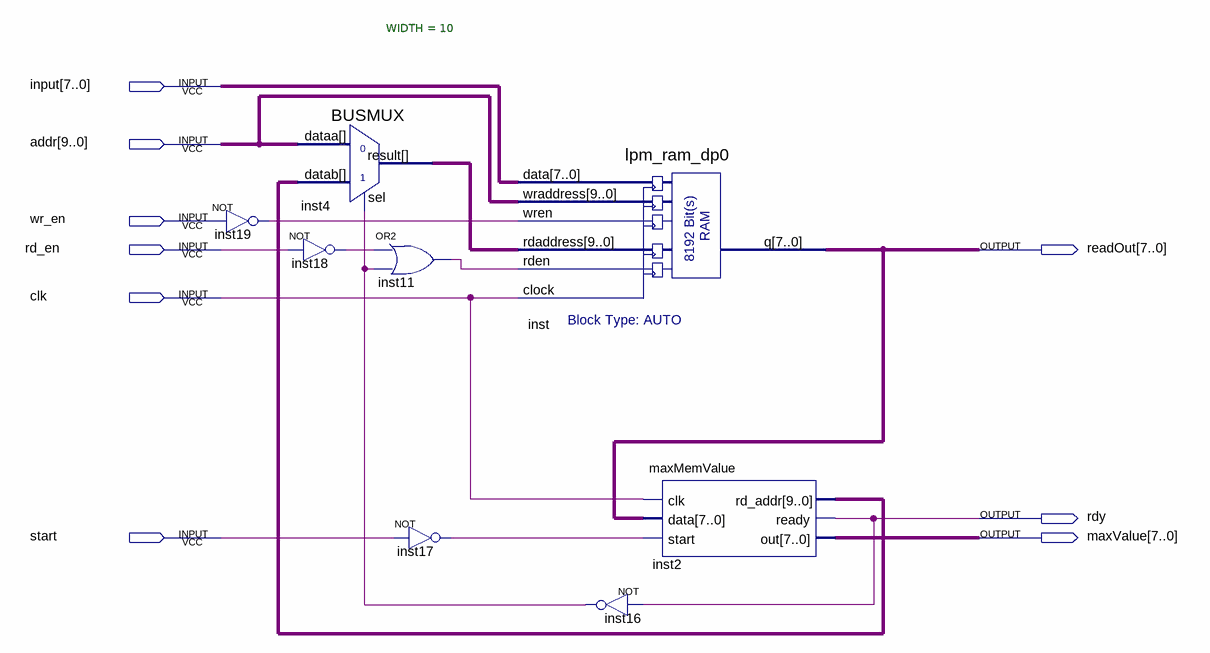
[diagram p0: schematic sheet]
// Quartus schematic MaxValStaticRAM.bdf as structural Verilog: 8 symbols, 9 pins
module MaxValStaticRAM (
  input  [7:0] \input ,
  input  [9:0] addr,
  input  wr_en,
  input  rd_en,
  input  clk,
  input  start,
  output [7:0] readOut,
  output rdy,
  output [7:0] maxValue
);

  wire inst11_out, inst16_out, inst17_out, inst18_out, inst19_out;
  wire [9:0] inst2_rd_addr, inst4_result;

  not inst19 (inst19_out, wr_en);
  BUSMUX #(.WIDTH(10)) inst4 (.datab(inst2_rd_addr), .sel(inst16_out), .dataa(addr), .result(inst4_result));
  not inst18 (inst18_out, rd_en);
  or inst11 (inst11_out, inst18_out, inst16_out);
  not inst17 (inst17_out, start);
  lpm_ram_dp0 inst (
    .data(\input ), .wraddress(addr), .wren(inst19_out), .rdaddress(inst4_result), .rden(inst11_out),
    .clock(clk), .q(readOut));
  not inst16 (inst16_out, rdy);
  maxMemValue inst2 (
    .clk(clk), .data(readOut), .start(inst17_out), .rd_addr(inst2_rd_addr), .ready(rdy), .out(maxValue));
endmodule
